# Altium schematic sheet MCU.SchDoc: STM32WB55RG microcontroller I/Os
size A4; Author: Ph.A; SheetNumber: 2; SheetTotal: 6
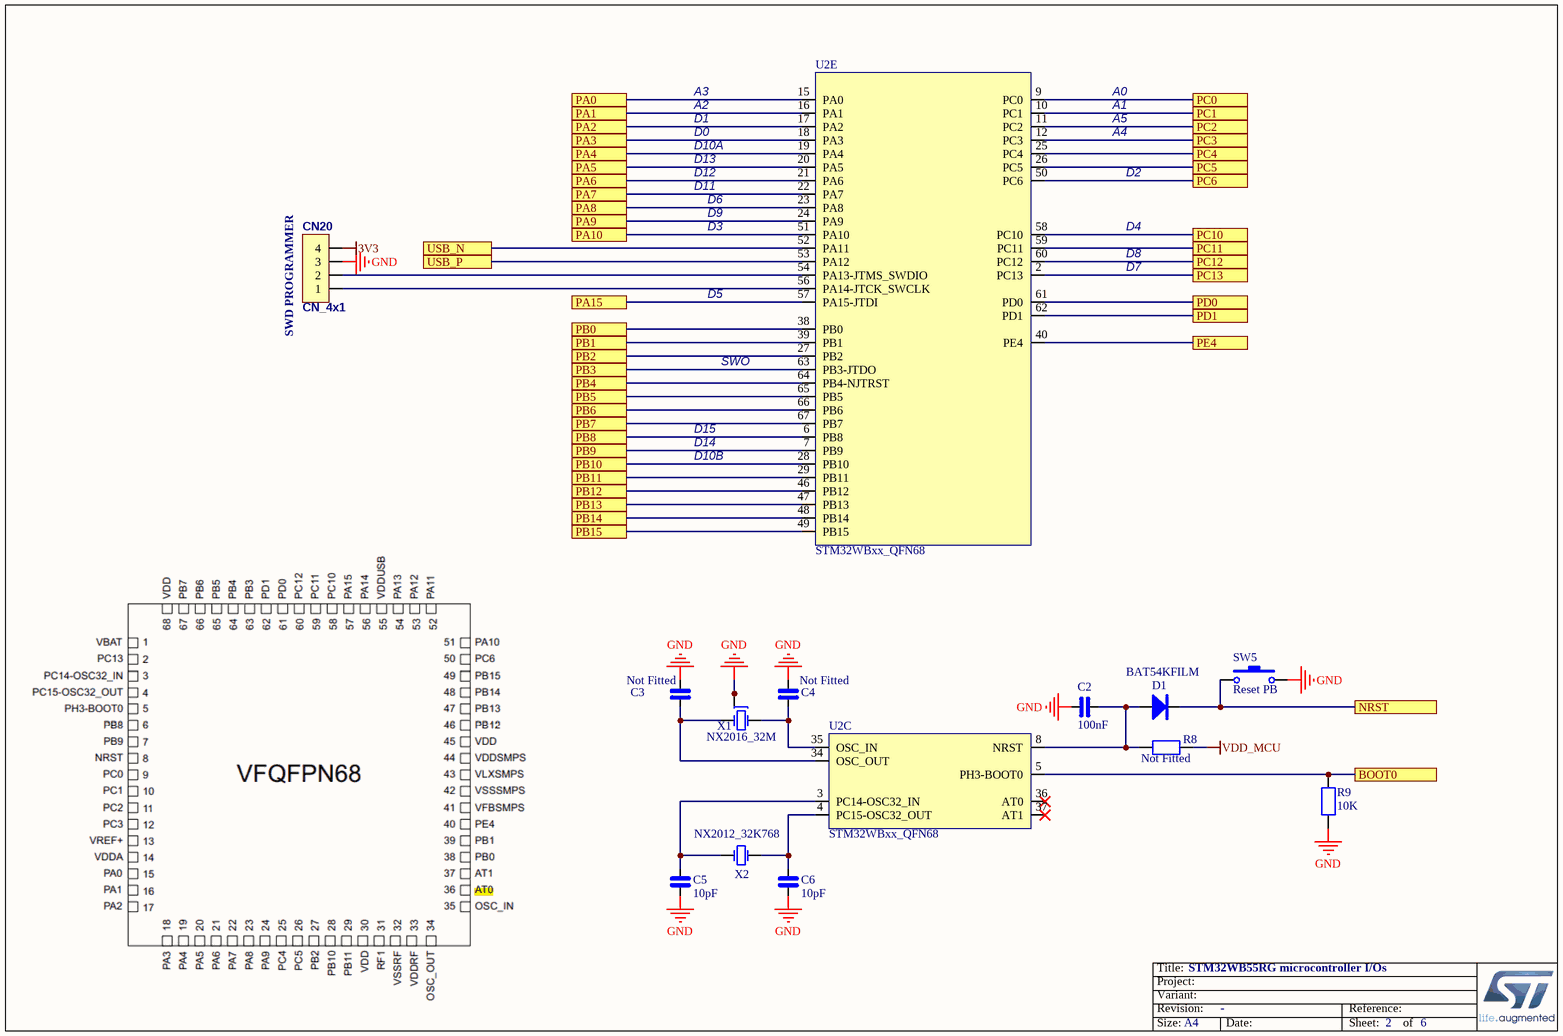
[diagram p0: MCU.SchDoc]

## Parts
C2  100nF  [0603_CAP_NPOL]
C3  Fitted: Not Fitted  [0603_CAP_NPOL]  (hidden comment: TBD)
C4  Fitted: Not Fitted  [0603_CAP_NPOL]  (hidden comment: TBD)
C5  10pF  [0603_CAP_NPOL]
C6  10pF  [0603_CAP_NPOL]
CN20  CN_4x1  [GP_4x1]
D1  BAT54KFILM  [SOD523]
R8  Fitted: Not Fitted  [0402_RES]  (hidden comment: 100K (not fitted))
R9  10K  [0402_RES]
SW5  Reset PB  [SW-PB SMD KMR2]
U2  STM32WBxx_QFN68  [VFQFPN68_8x8x0.1_p0.4]  (parts C,E of 5)
X1  NX2016_32M  [NX2016_4P]
X2  NX2012_32K768  [NX2012_2P]

## Ports
BOOT0, NRST, PA0, PA1, PA2, PA3, PA4, PA5, PA6, PA7, PA8, PA9, PA10, PA15, PB0, PB1, PB2, PB3, PB4, PB5, PB6, PB7, PB8, PB9, PB10, PB11, PB12, PB13, PB14, PB15, PC0, PC1, PC2, PC3, PC4, PC5, PC6, PC10, PC11, PC12, PC13, PD0, PD1, PE4, USB_N, USB_P

## Nets
3V3: CN20.4
GND: C2.1 C3.2 C4.2 C5.2 C6.2 CN20.3 R9.2 SW5.2 X1.2 X1.4
VDD_MCU: R8.1
BOOT0: R9.1 U2.5(PH3-BOOT0) ; port BOOT0
NRST: D1.K SW5.1 ; port NRST
PA0: U2.15(PA0) ; port PA0
PA1: U2.16(PA1) ; port PA1
PA2: U2.17(PA2) ; port PA2
PA3: U2.18(PA3) ; port PA3
PA4: U2.19(PA4) ; port PA4
PA5: U2.20(PA5) ; port PA5
PA6: U2.21(PA6) ; port PA6
PA7: U2.22(PA7) ; port PA7
PA8: U2.23(PA8) ; port PA8
PA9: U2.24(PA9) ; port PA9
PA10: U2.51(PA10) ; port PA10
PA15: U2.57(PA15-JTDI) ; port PA15
PB0: U2.38(PB0) ; port PB0
PB1: U2.39(PB1) ; port PB1
PB2: U2.27(PB2) ; port PB2
PB3: U2.63(PB3-JTDO) ; port PB3
PB4: U2.64(PB4-NJTRST) ; port PB4
PB5: U2.65(PB5) ; port PB5
PB6: U2.66(PB6) ; port PB6
PB7: U2.67(PB7) ; port PB7
PB8: U2.6(PB8) ; port PB8
PB9: U2.7(PB9) ; port PB9
PB10: U2.28(PB10) ; port PB10
PB11: U2.29(PB11) ; port PB11
PB12: U2.46(PB12) ; port PB12
PB13: U2.47(PB13) ; port PB13
PB14: U2.48(PB14) ; port PB14
PB15: U2.49(PB15) ; port PB15
PC0: U2.9(PC0) ; port PC0
PC1: U2.10(PC1) ; port PC1
PC2: U2.11(PC2) ; port PC2
PC3: U2.12(PC3) ; port PC3
PC4: U2.25(PC4) ; port PC4
PC5: U2.26(PC5) ; port PC5
PC6: U2.50(PC6) ; port PC6
PC10: U2.58(PC10) ; port PC10
PC11: U2.59(PC11) ; port PC11
PC12: U2.60(PC12) ; port PC12
PC13: U2.2(PC13) ; port PC13
PD0: U2.61(PD0) ; port PD0
PD1: U2.62(PD1) ; port PD1
PE4: U2.40(PE4) ; port PE4
USB_N: U2.52(PA11) ; port USB_N
USB_P: U2.53(PA12) ; port USB_P
NetC2_2: C2.2 D1.A R8.2 U2.8(NRST)
NetC3_1: C3.1 U2.34(OSC_OUT) X1.3(OSC2)
NetC4_1: C4.1 U2.35(OSC_IN) X1.1(OSC1)
NetC5_1: C5.1 U2.3(PC14-OSC32_IN) X2.1(OSC1)
NetC6_1: C6.1 U2.4(PC15-OSC32_OUT) X2.2(OSC2)
NetCN20_1: CN20.1 U2.56(PA14-JTCK_SWCLK)
NetCN20_2: CN20.2 U2.54(PA13-JTMS_SWDIO)

Not connected (* = marked no-connect by the designer): U2 36(AT0)* 37(AT1)*

## Notes on the sheet
- A2
- A3
- A0
- A1
- D12
- D13
- D0
- D1
- D10A
- A4
- A5
- D2
- D11
- D9
- D3
- D6
- D4
- (near CN20) SWD PROGRAMMER
- D5
- D7
- D8
- SWO
- D14
- D15
- D10B
- Title:
- Project:
- Size:
- Revision:
- Variant:
- -
- Date:
- Reference:
- Sheet:
- of

## Library data of the parts
C2-C6 = CAP_NPOL: Capacitor_not polarized
D1 = BAT54K: Schottky Diode
R8 R9 = RES: Resistor
SW5 = SW-PB_1: Push-button SMD; Order code RS: 102-412
X1 = NX2016_32M: Crystal NDK 2.0x1.6mm  32 MHz; Manufacturer P/N: NX2016SA 32 MHz EXS00A-CS06654; Ref: NX2016SA 32MHz  EXS00A-CS06654  Référence interne NDK : X5087283; Manufacturer: NDK
X2 = NX2012_32K768: Crystal NDK 2.0x1.2mm  32.768 KHz; Manufacturer P/N: NX2012SA 32.768KHz  EXS00A-MU00389; Ref: NX2012SA 32.768KHz  EXS00A-MU00389  Référence interne NDK : X3037088; Manufacturer: NDK